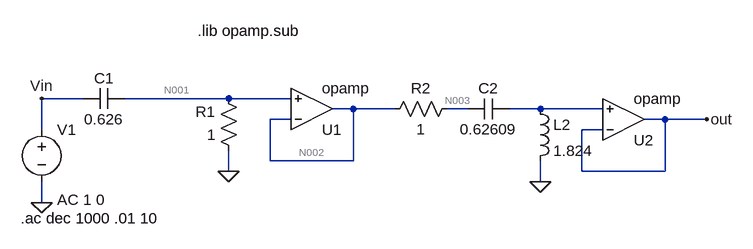
[diagram p0: schematic 26TS_3.asc]
26TS_3.asc, the LTspice schematic file:
Version 4.1
SHEET 1 1384 680
WIRE -128 80 -192 80
WIRE 96 80 -64 80
WIRE 192 80 96 80
WIRE 288 96 256 96
WIRE 352 96 288 96
WIRE 464 96 432 96
WIRE 576 96 528 96
WIRE 672 96 576 96
WIRE 192 112 160 112
WIRE 768 112 736 112
WIRE 832 112 768 112
WIRE -192 128 -192 80
WIRE 672 128 640 128
WIRE 160 176 160 112
WIRE 288 176 288 96
WIRE 288 176 160 176
WIRE 96 192 96 160
WIRE 640 192 640 128
WIRE 768 192 768 112
WIRE 768 192 640 192
WIRE 576 208 576 176
WIRE -192 240 -192 208
FLAG 96 192 0
FLAG -192 240 0
FLAG 576 208 0
FLAG -192 80 Vin
FLAG 832 112 out
SYMBOL cap -64 64 R90
WINDOW 0 0 32 VBottom 2
WINDOW 3 32 32 VTop 2
SYMATTR InstName C1
SYMATTR Value 0.626
SYMBOL res 112 176 R180
WINDOW 0 36 76 Left 2
WINDOW 3 36 40 Left 2
SYMATTR InstName R1
SYMATTR Value 1
SYMBOL OpAmps\\opamp 224 160 M180
SYMATTR InstName U1
SYMBOL voltage -192 112 R0
WINDOW 123 24 124 Left 2
WINDOW 39 0 0 Left 0
SYMATTR Value2 AC 1 0
SYMATTR InstName V1
SYMATTR Value ""
SYMBOL cap 528 80 R90
WINDOW 0 0 32 VBottom 2
WINDOW 3 32 32 VTop 2
SYMATTR InstName C2
SYMATTR Value 0.62609
SYMBOL res 448 80 R90
WINDOW 0 0 56 VBottom 2
WINDOW 3 32 56 VTop 2
SYMATTR InstName R2
SYMATTR Value 1
SYMBOL ind 560 80 R0
SYMATTR InstName L2
SYMATTR Value 1.824
SYMATTR SpiceLine Rser=1m
SYMBOL OpAmps\\opamp 704 176 M180
SYMATTR InstName U2
TEXT -224 264 Left 2 !.ac dec 1000 .01 10
TEXT 48 -24 Left 2 !.lib opamp.sub

The netlist it stands for:
* 26TS_3.asc
C1 N001 Vin 0.626
R1 0 N001 1
X§U1 N002 N001 N002 opamp Aol=100K GBW=10Meg  ; pins invin noninvin out
V1 Vin 0 AC 1 0
C2 N004 N003 0.62609
R2 N003 N002 1
L2 N004 0 1.824 Rser=1m
X§U2 out N004 out opamp Aol=100K GBW=10Meg  ; pins invin noninvin out
.ac dec 1000 .01 10
.lib opamp.sub
.backanno
.end

* Results of the author's LTspice run, read from the files saved beside the schematic
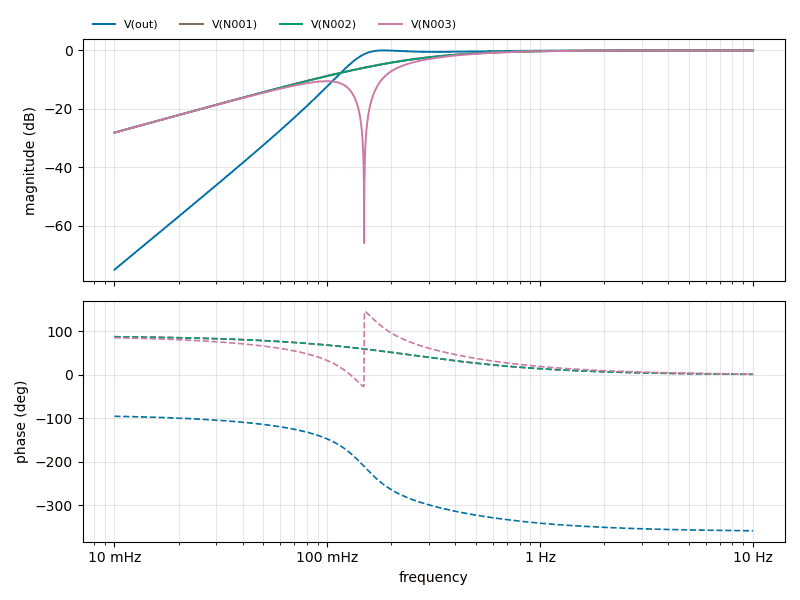
[diagram p1: AC Analysis of 26TS_3.asc, plotted from the saved traces]
* AC Analysis, 1 run:
*   V(out): -75.00 dB at 10 mHz, -0.00 dB at 10 Hz, peak -0.00 dB at 10 Hz, 3 dB below the peak at 136.4 mHz
*   V(N001): -28.11 dB at 10 mHz, -0.00 dB at 10 Hz, peak -0.00 dB at 10 Hz, 3 dB below the peak at 254.1 mHz
*   V(N002): -28.11 dB at 10 mHz, -0.00 dB at 10 Hz, peak -0.00 dB at 10 Hz, 3 dB below the peak at 254.1 mHz
*   V(N003): -28.12 dB at 10 mHz, -0.00 dB at 10 Hz, peak -0.00 dB at 10 Hz, 3 dB below the peak at 296.9 mHz